# Altium schematic sheet STM32.SchDoc
size OrCAD B
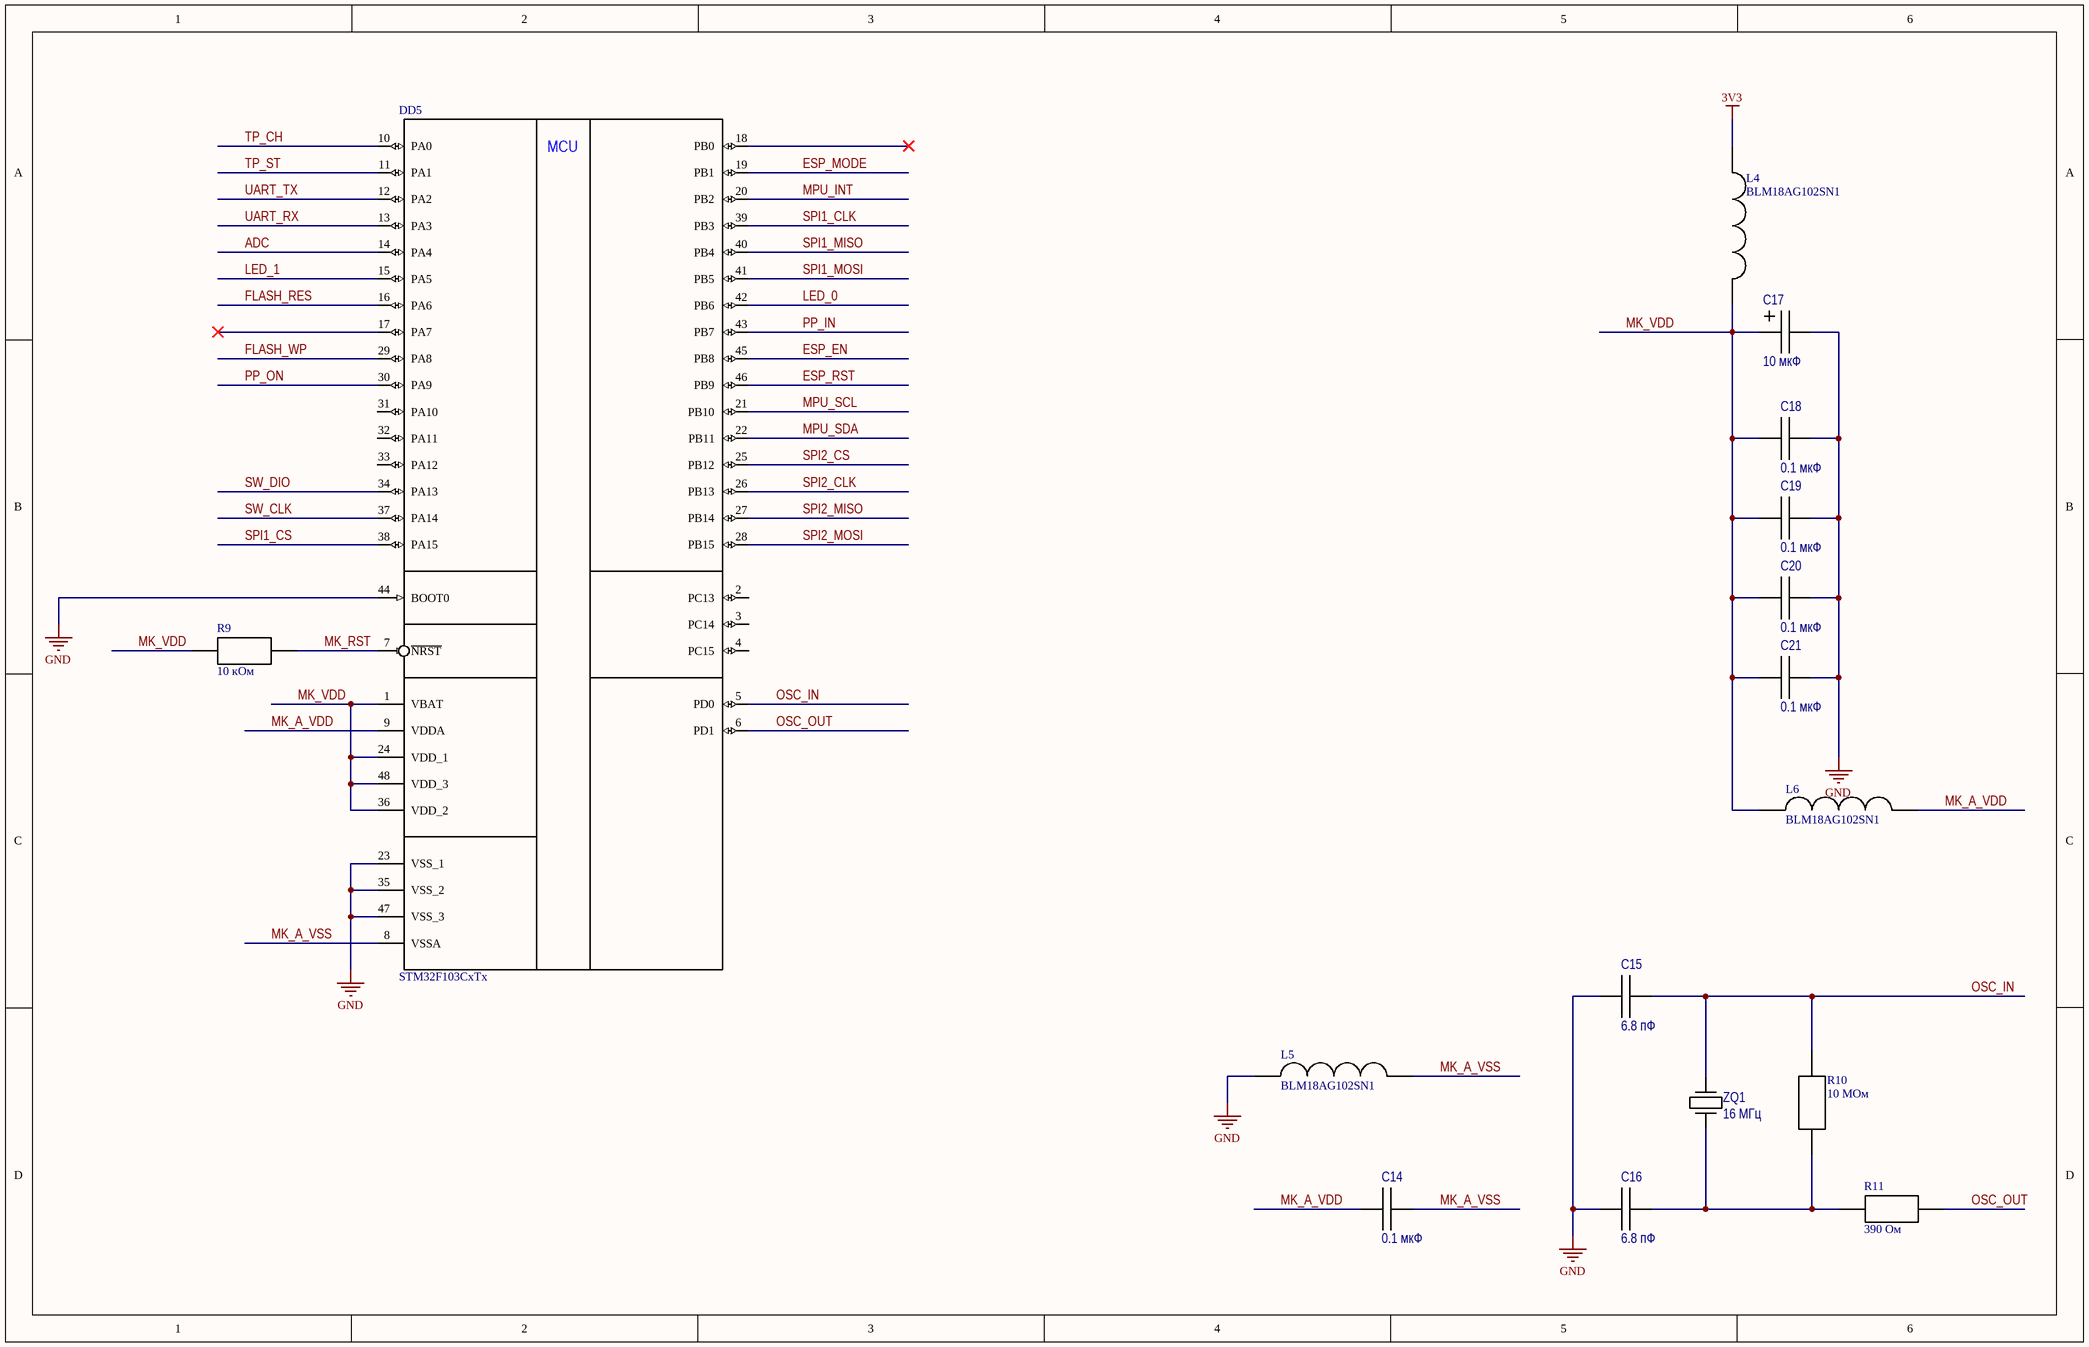
[diagram p0: STM32.SchDoc]

## Parts
C14  0.1 мкФ  [C 1206]
C15  6.8 пФ  [C 1206]
C16  6.8 пФ  [C 1206]
C17  10 мкФ  [C TAN_C]
C18  0.1 мкФ  [C 1206]
C19  0.1 мкФ  [C 1206]
C20  0.1 мкФ  [C 1206]
C21  0.1 мкФ  [C 1206]
DD5  STM32F103CxTx  [TSQFP50P900X900X160-48N]
L4  BLM18AG102SN1  [FB 0603]
L5  BLM18AG102SN1  [FB 0603]
L6  BLM18AG102SN1  [FB 0603]
R9  10 кОм  [RES 0805]
R10  10 МОм  [RES 0805]
R11  390 Ом  [RES 0805]
ZQ1  value 16 МГц  [NX3225SA]  (hidden comment: NX3225SA-16.000M-STD-CRS-2)

## Nets
3V3: L4.1
GND: C15.1 C16.1 C17.2 C18.2 C19.2 C20.2 C21.2 DD5.23(VSS_1) DD5.35(VSS_2) DD5.44(BOOT0) DD5.47(VSS_3) L5.1
ADC: DD5.14(PA4)
ESP_EN: DD5.45(PB8)
ESP_MODE: DD5.19(PB1)
ESP_RST: DD5.46(PB9)
FLASH_RES: DD5.16(PA6)
FLASH_WP: DD5.29(PA8)
LED_0: DD5.42(PB6)
LED_1: DD5.15(PA5)
MK_A_VDD: C14.1 DD5.9(VDDA) L6.2
MK_A_VSS: C14.2 DD5.8(VSSA) L5.2
MK_RST: DD5.7(~{NRST}) R9.1
MK_VDD: C17.1 C18.1 C19.1 C20.1 C21.1 DD5.1(VBAT) DD5.24(VDD_1) DD5.36(VDD_2) DD5.48(VDD_3) L4.2 L6.1 R9.2
MPU_INT: DD5.20(PB2)
MPU_SCL: DD5.21(PB10)
MPU_SDA: DD5.22(PB11)
OSC_IN: C15.2 DD5.5(PD0) R10.2 ZQ1.3(XO)
OSC_OUT: DD5.6(PD1) R11.2
PP_IN: DD5.43(PB7)
PP_ON: DD5.30(PA9)
SPI1_CLK: DD5.39(PB3)
SPI1_CS: DD5.38(PA15)
SPI1_MISO: DD5.40(PB4)
SPI1_MOSI: DD5.41(PB5)
SPI2_CLK: DD5.26(PB13)
SPI2_CS: DD5.25(PB12)
SPI2_MISO: DD5.27(PB14)
SPI2_MOSI: DD5.28(PB15)
SW_CLK: DD5.37(PA14)
SW_DIO: DD5.34(PA13)
TP_CH: DD5.10(PA0)
TP_ST: DD5.11(PA1)
UART_RX: DD5.13(PA3)
UART_TX: DD5.12(PA2)
NetC16_2: C16.2 R10.1 R11.1 ZQ1.1(XI)

Not connected (* = marked no-connect by the designer): DD5 2(PC13) 3(PC14) 4(PC15) 17(PA7)* 18(PB0)* 31(PA10) 32(PA11) 33(PA12); ZQ1 2(NC) 4(NC)

## Notes on the sheet
- (in symbol STM32F103CxTx) MCU

## Library data of the parts
C14-C16 C18-C21 = CAP 1206: SMD Capacitor 1206; Manufacturer: /Укажите компанию-производителя/; Tolerance: /Укажите допуск в процентах/; Temperature coefficient: /Формат: ±? ppm/°C/; Type: Конденсатор керамический; TC: /Укажите тип диэлектрика/; Size: 1206; Temperature range: /Формат: -? ... ? °C/
  C14 C18-C21: Value: 0.1 мкФ
  C15 C16: Value: 6.8 пФ
C17 = CAP TAN_C: SMD Tantalium Capacitor C; Manufacturer: /Укажите компанию-производителя/; Tolerance: /Укажите допуск в процентах/; Type: Конденсатор танталовый; ESR: /Укажите значение ЭПС/; Size: C; Temperature range: /Формат: -? ... ? °C/; Value: 10 мкФ
R9-R11 = RES 0805
ZQ1 = NX3225SA-16.000M-STD-CRS-2: QUARTZ CRYSTAL; Manufacturer: NDK; Load capacitance: 8 пФ; Frequency stability: ±15 ppm; Type: Кварцевый резонатор; Temperature range: -40 ... 125 °C